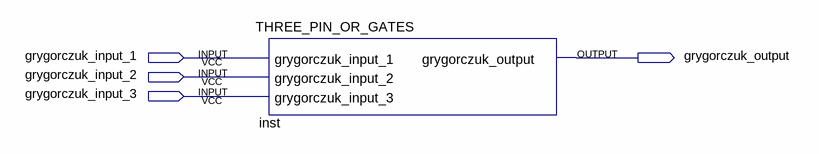
[diagram p0: schematic sheet]
// Quartus schematic THREE_PIN_OR_SYMBOL.bdf as structural Verilog: 1 symbols, 4 pins
module THREE_PIN_OR_SYMBOL (
  input  grygorczuk_input_1,
  input  grygorczuk_input_2,
  input  grygorczuk_input_3,
  output grygorczuk_output
);

  THREE_PIN_OR_GATES inst (
    .grygorczuk_input_1(grygorczuk_input_1), .grygorczuk_input_2(grygorczuk_input_2),
    .grygorczuk_input_3(grygorczuk_input_3), .grygorczuk_output(grygorczuk_output));
endmodule
